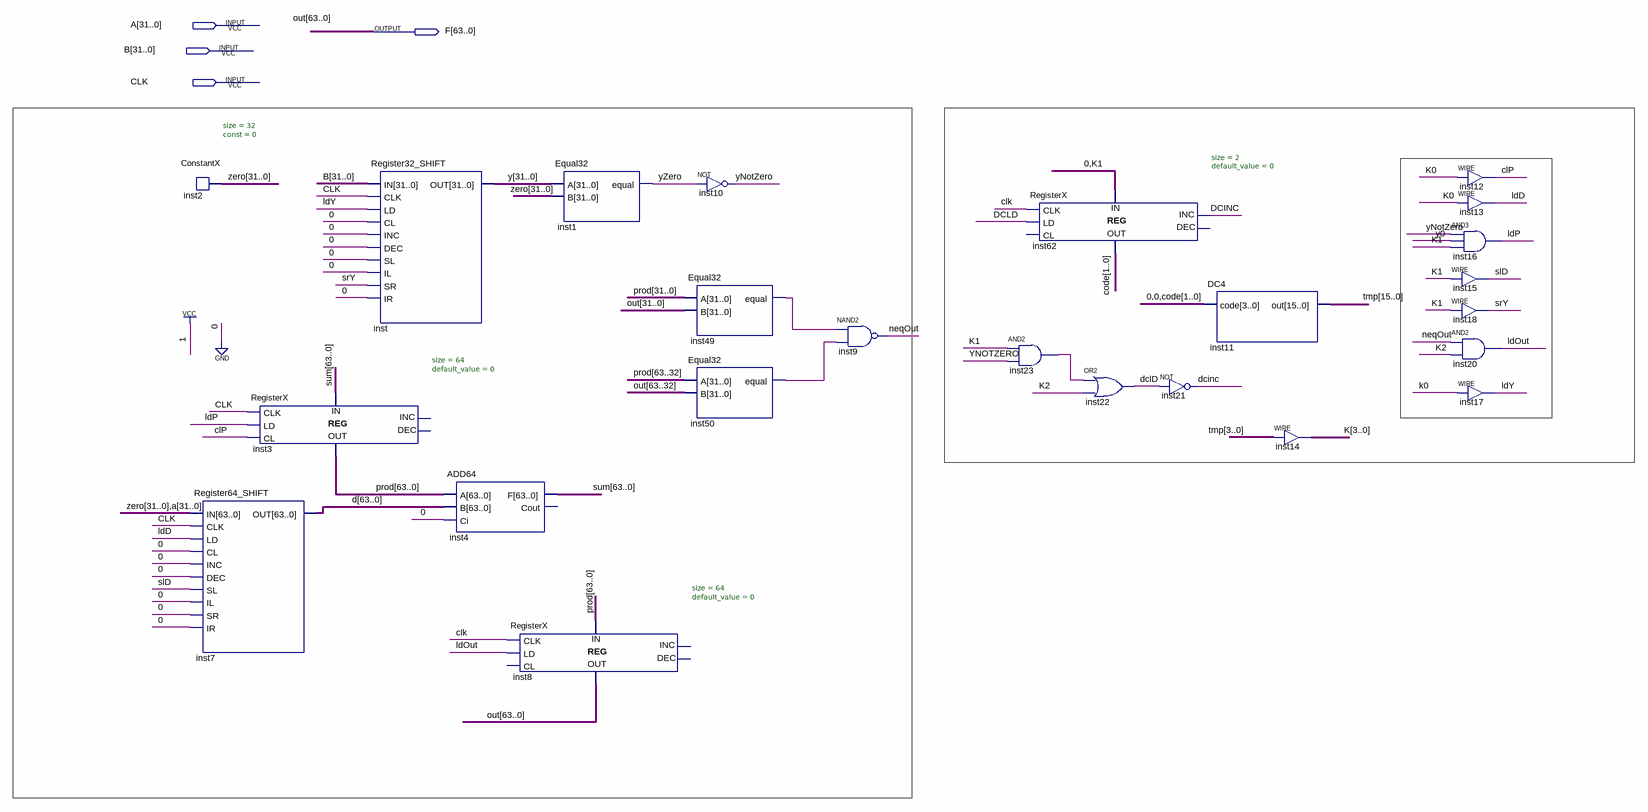
[diagram p0: schematic sheet]
// Quartus schematic Mult64CheapUnsigned.bdf as structural Verilog: 24 symbols, 4 pins
module Mult64CheapUnsigned (
  input  [31:0] A,
  input  [31:0] B,
  input  CLK,
  output [63:0] F
);

  wire clP, DCINC, DCLD, inst23_out, inst49_equal, inst50_equal, ldD, ldOut, ldP, ldY, neqOut, slD, srY,
       yNotZero, yZero;
  wire [1:0] code;
  wire [3:0] K;
  wire [15:0] tmp;
  wire [31:0] y, zero;
  wire [63:0] d, prod, sum;

  ConstantX #(.size(32), .\const (0)) inst2 (.DATA_OUT(zero));
  Register64_SHIFT inst7 (
    .IN({zero, A}), .CLK(CLK), .LD(ldD), .CL(1'b0), .INC(1'b0), .DEC(1'b0), .SL(slD), .IL(1'b0), .SR(1'b0),
    .IR(1'b0), .OUT(d));
  RegisterX #(.size(64), .default_value(0)) inst3 (
    .CLK(CLK), .LD(ldP), .CL(clP), .DATA_IN(sum), .DATA_OUT(prod));  // open: INC, DEC
  Register32_SHIFT inst (
    .IN(B), .CLK(CLK), .LD(ldY), .CL(1'b0), .INC(1'b0), .DEC(1'b0), .SL(1'b0), .IL(1'b0), .SR(srY),
    .IR(1'b0), .OUT(y));
  ADD64 inst4 (.A(prod), .B(d), .Ci(1'b0), .F(sum));  // open: Cout
  RegisterX #(.size(64), .default_value(0)) inst8 (
    .CLK(CLK), .LD(ldOut), .DATA_IN(prod), .DATA_OUT(F));  // open: CL, INC, DEC
  Equal32 inst1 (.A(y), .B(zero), .equal(yZero));
  not inst10 (yNotZero, yZero);
  Equal32 inst49 (.A(prod[31:0]), .B(F[31:0]), .equal(inst49_equal));
  Equal32 inst50 (.A(prod[63:32]), .B(F[63:32]), .equal(inst50_equal));
  nand inst9 (neqOut, inst49_equal, inst50_equal);
  RegisterX #(.size(2), .default_value(0)) inst62 (
    .CLK(CLK), .LD(DCLD), .INC(DCINC), .DATA_IN({1'b0, K[1]}), .DATA_OUT(code));  // open: CL, DEC
  and inst23 (inst23_out, K[1], yNotZero);
  or inst22 (DCLD, inst23_out, K[2]);
  DC4 inst11 (.code({2'b00, code}), .out(tmp));
  not inst21 (DCINC, DCLD);
  assign K = tmp[3:0];  // WIRE inst14
  assign clP = K[0];  // WIRE inst12
  assign ldD = K[0];  // WIRE inst13
  and inst16 (ldP, yNotZero, y[0], K[1]);
  assign slD = K[1];  // WIRE inst15
  assign srY = K[1];  // WIRE inst18
  and inst20 (ldOut, neqOut, K[2]);
  assign ldY = K[0];  // WIRE inst17

  // Other names for the same wires on the sheet: out[63:0] = F
endmodule
